# Altium schematic sheet full_bridge.SchDoc
size A4; Author: Mikołaj Pichita; CompanyName: AGH University of Science and Technology; SheetNumber: 5; SheetTotal: 16
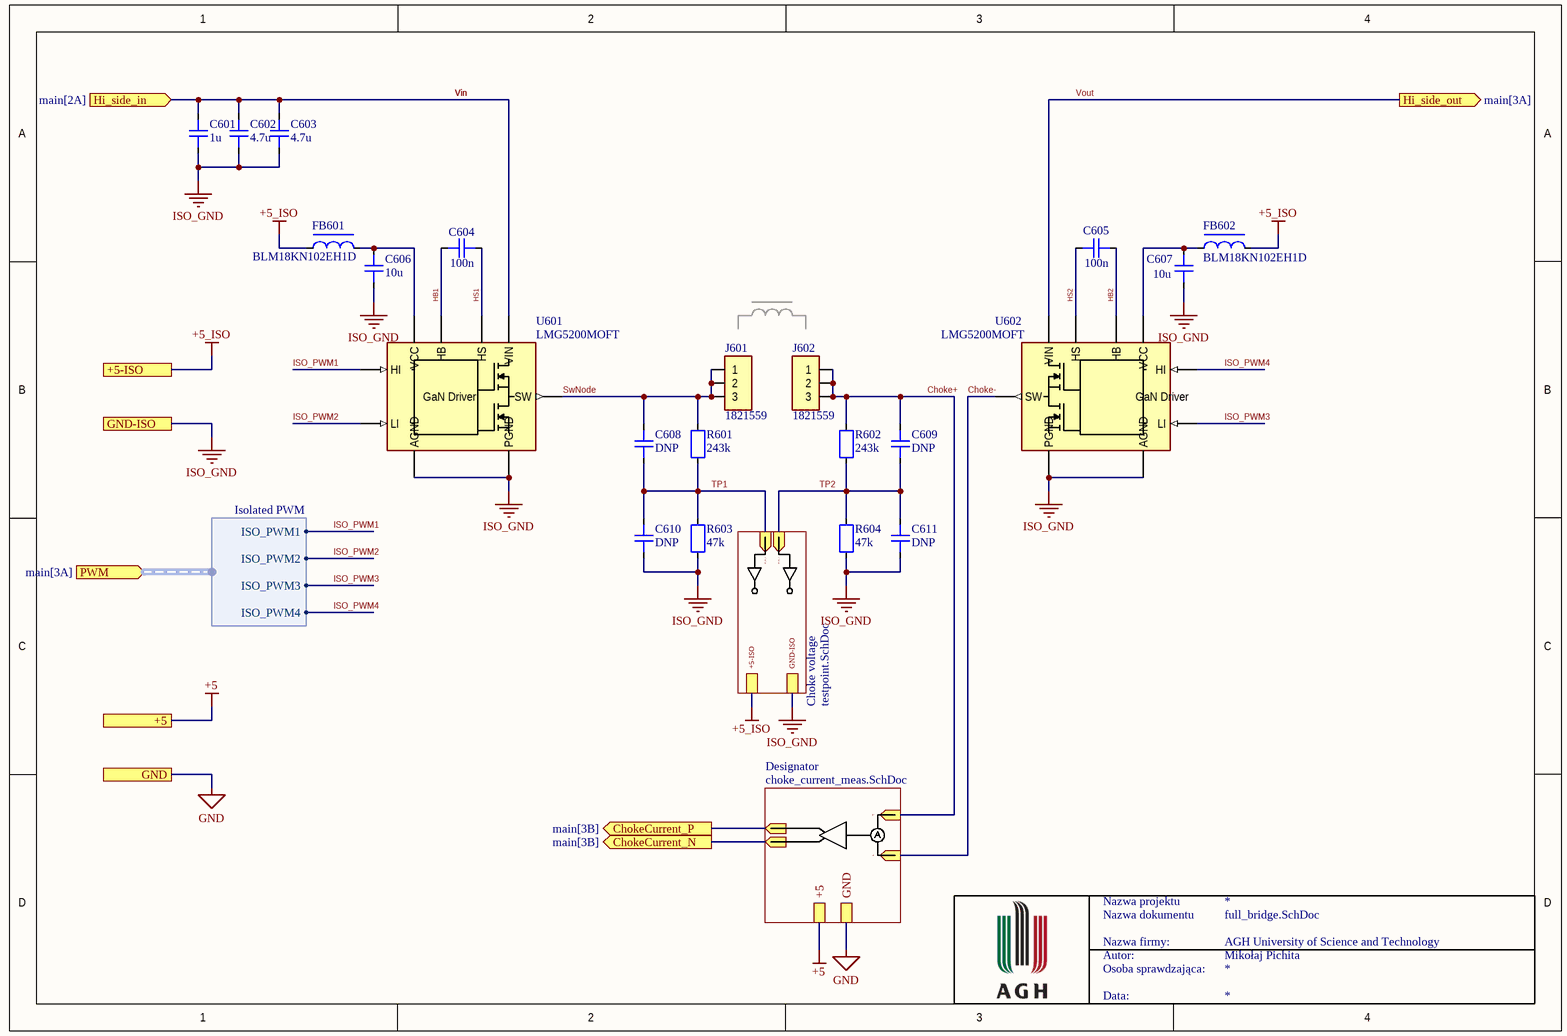
[diagram p0: full_bridge.SchDoc]

## Parts
C601  1u  [CAP0603]
C602  4.7u  [CAP1206]
C603  4.7u  [CAP1206]
C604  100n  [CAP0603]
C605  100n  [CAP0603]
C606  10u  [CAP1206]
C607  10u  [CAP1206]
C608  DNP  [CAP0603]  (no BOM)
C609  DNP  [CAP0603]  (no BOM)
C610  DNP  [CAP0603]  (no BOM)
C611  DNP  [CAP0603]  (no BOM)
FB601  BLM18KN102EH1D  [RES0603]
FB602  BLM18KN102EH1D  [RES0603]
J601  1821559  [1844882]
J602  1821559  [1844882]
R601  243k  [RES0603]
R602  243k  [RES0603]
R603  47k  [RES0603]
R604  47k  [RES0603]
U601  LMG5200MOFT  [FP-MOF0009A-MFG]
U602  LMG5200MOFT  [FP-MOF0009A-MFG]

## Sub-sheets
Choke voltage = testpoint.SchDoc: TP_IN_1 (in), TP_IN_2 (in), +5-ISO, GND-ISO
Designator = choke_current_meas.SchDoc: IP+ (in), IP- (in), measP (out), measN (out), +5, GND

## Ports
+5 (see main[2B], choke_current_meas[4B], current_sense_shunt[4A], isolator[1B], measurements[1C], microcontroller[1C], power_supply[2B], voltage_sense[4A]), +5-ISO (see main[2B], isolator[4B], measurements[1B], OV_OC[1B], power_supply[3B], testpoint[1A]), ChokeCurrent_N (out, see main[3B]), ChokeCurrent_P (out, see main[3B]), GND (see main[3B], choke_current_meas[4B], current_sense_shunt[4A], isolator[1B], measurements[1C], microcontroller[1C], power_supply[1B], voltage_sense[4A]), GND-ISO (see main[2B], input_filter[2C], isolator[4B], measurements[1B], output_filter[1B], OV_OC[1B], power_supply[3B], testpoint[1A], voltage_sense[1A]), Hi_side_in (in, see main[2A]), Hi_side_out (out, see main[3A]), PWM (in, harness Isolated PWM, see main[3A])

## Harnesses
Isolated PWM: ISO_PWM1, ISO_PWM2, ISO_PWM3, ISO_PWM4

## Nets
+5: port +5, sheet Designator/+5
+5_ISO: FB601.1 FB602.1 ; port +5-ISO, sheet Choke voltage/+5-ISO
GND: port GND, sheet Designator/GND
ISO_GND: C601.2 C602.2 C603.2 C606.2 C607.1 C610.2 C611.2 R603.2 R604.2 U601.7(AGND) U601.9(PGND) U602.7(AGND) U602.9(PGND) ; port GND-ISO, sheet Choke voltage/GND-ISO
Choke+: C609.1 J602.1 J602.2 J602.3 R602.1 ; sheet Designator/IP+
Choke-: U602.8(SW) ; sheet Designator/IP-
ChokeCurrent_N: port ChokeCurrent_N, sheet Designator/measN
ChokeCurrent_P: port ChokeCurrent_P, sheet Designator/measP
HB1: C604.2 U601.2(HB)
HB2: C605.1 U602.2(HB)
HS1: C604.1 U601.3(HS)
HS2: C605.2 U602.3(HS)
ISO_PWM1: U601.4(HI) ; port PWM.ISO_PWM1
ISO_PWM2: U601.5(LI) ; port PWM.ISO_PWM2
ISO_PWM3: U602.5(LI) ; port PWM.ISO_PWM3
ISO_PWM4: U602.4(HI) ; port PWM.ISO_PWM4
SwNode: C608.1 J601.1 J601.2 J601.3 R601.1 U601.8(SW)
TP1: C608.2 C610.1 R601.2 R603.1 ; sheet Choke voltage/TP_IN_2
TP2: C609.2 C611.1 R602.2 R604.1 ; sheet Choke voltage/TP_IN_1
Vin: C601.1 C602.1 C603.1 U601.1(VIN) ; port Hi_side_in
Vout: U602.1(VIN) ; port Hi_side_out
NetC606_1: C606.1 FB601.2 U601.6(VCC)
NetC607_2: C607.2 FB602.2 U602.6(VCC)

## Notes on the sheet
- Nazwa projektu
- Nazwa dokumentu
- Nazwa firmy:
- Autor:
- Osoba sprawdzająca:
- Data:
- (in symbol LMG5200MOFT) GaN Driver

## Library data of the parts
C601-C611 = Capacitor: Value: *; HelpURL: *; MPN: *; Supplier: *; SupplierPartNumber: *
  C602 C603: Supplier 1: Mouser; Supplier Part Number 1: 581-12065C475KAT4A
  C604 C605: Supplier 1: Mouser; Supplier Part Number 1: 581-06035C104KAT2A
  C606 C607: Supplier 1: Mouser; Supplier Part Number 1: 581-1206DD106MAT2A
FB601 FB602 = Ferrite Bead: Value: *; HelpURL: *; MPN: *; Supplier: *; SupplierPartNumber: *; Supplier 1: Mouser; Supplier Part Number 1: 81-BLM18KN102EH1D
R601-R604 = Resistor: Value: *; HelpURL: *; MPN: *; Supplier: *; SupplierPartNumber: *; Supplier 1: Mouser
  R601 R602: Supplier Part Number 1: 71-CRCW0603-243K-E3
  R603 R604: Supplier Part Number 1: 603-RC0603FR-0747KL
U601 U602 = LMG5200MOFT: 10-A GaN Half-Bridge Power Stage; Output Current per Channel: 10A; Interface: Logic; Min Operating Temperature: -40°C; Mount: Surface Mount; Case/Package: QFN; RoHS Compliant: Yes; Packaging: Cut Tape; Max Operating Temperature: 125°C; Number of Pins: 9
J601 J602 = 1821559: Value: *; HelpURL: *; MPN: *; Supplier: *; SupplierPartNumber: *; Supplier 1: Mouser; Supplier Part Number 1: 651-1821559